# Altium schematic sheet main.SchDoc
size A
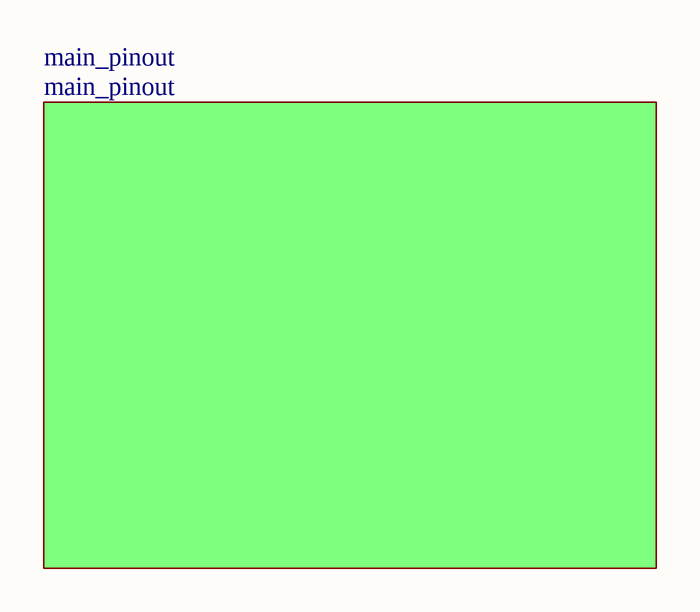
[diagram p0: main.SchDoc]

## Sub-sheets
main_pinout = main_pinout: no entries